# EAGLE design switch (EAGLE 9.2.2)
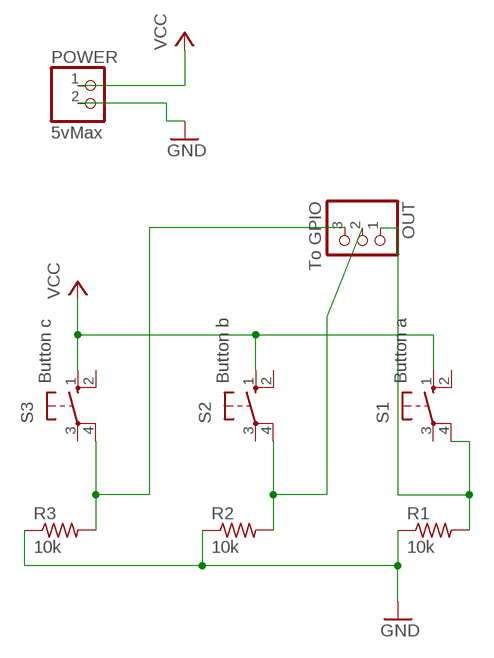
[diagram p0: schematic, sheet 1]

## Parts
OUT  To GPIO  PINHD-1X3  [1X03]
POWER  5vMax  PINHD-1X2  [1X02]
R1  10k  R-US_0204/7  [0204/7]
R2  10k  R-US_0204/7  [0204/7]
R3  10k  R-US_0204/7  [0204/7]
S1  Button a  10-XX  [B3F-10XX]
S2  Button b  10-XX  [B3F-10XX]
S3  Button c  10-XX  [B3F-10XX]

## Nets
GND: POWER.2 R1.1 R2.1 R3.1
N$1: OUT.3 R3.2 S3.4(P1)
N$2: OUT.2 R2.2 S2.4(P1)
N$3: OUT.1 R1.2 S1.4(P1)
VCC: POWER.1 S1.1(S) S2.1(S) S3.1(S)
Unconnected: S1.2(S1) S1.3(P) S2.2(S1) S2.3(P) S3.2(S1) S3.3(P)

## Library data of the parts
OUT = pinhead:PINHD-1X3: PIN HEADER
POWER = pinhead:PINHD-1X2: PIN HEADER
R1-R3 = adafruit:R-US_: RESISTOR, American symbol
S1-S3 = switch-omron:10-XX: OMRON SWITCH; MPN: B3F-1000; OC_FARNELL: 176432; OC_NEWARK: 36M3542

## Board
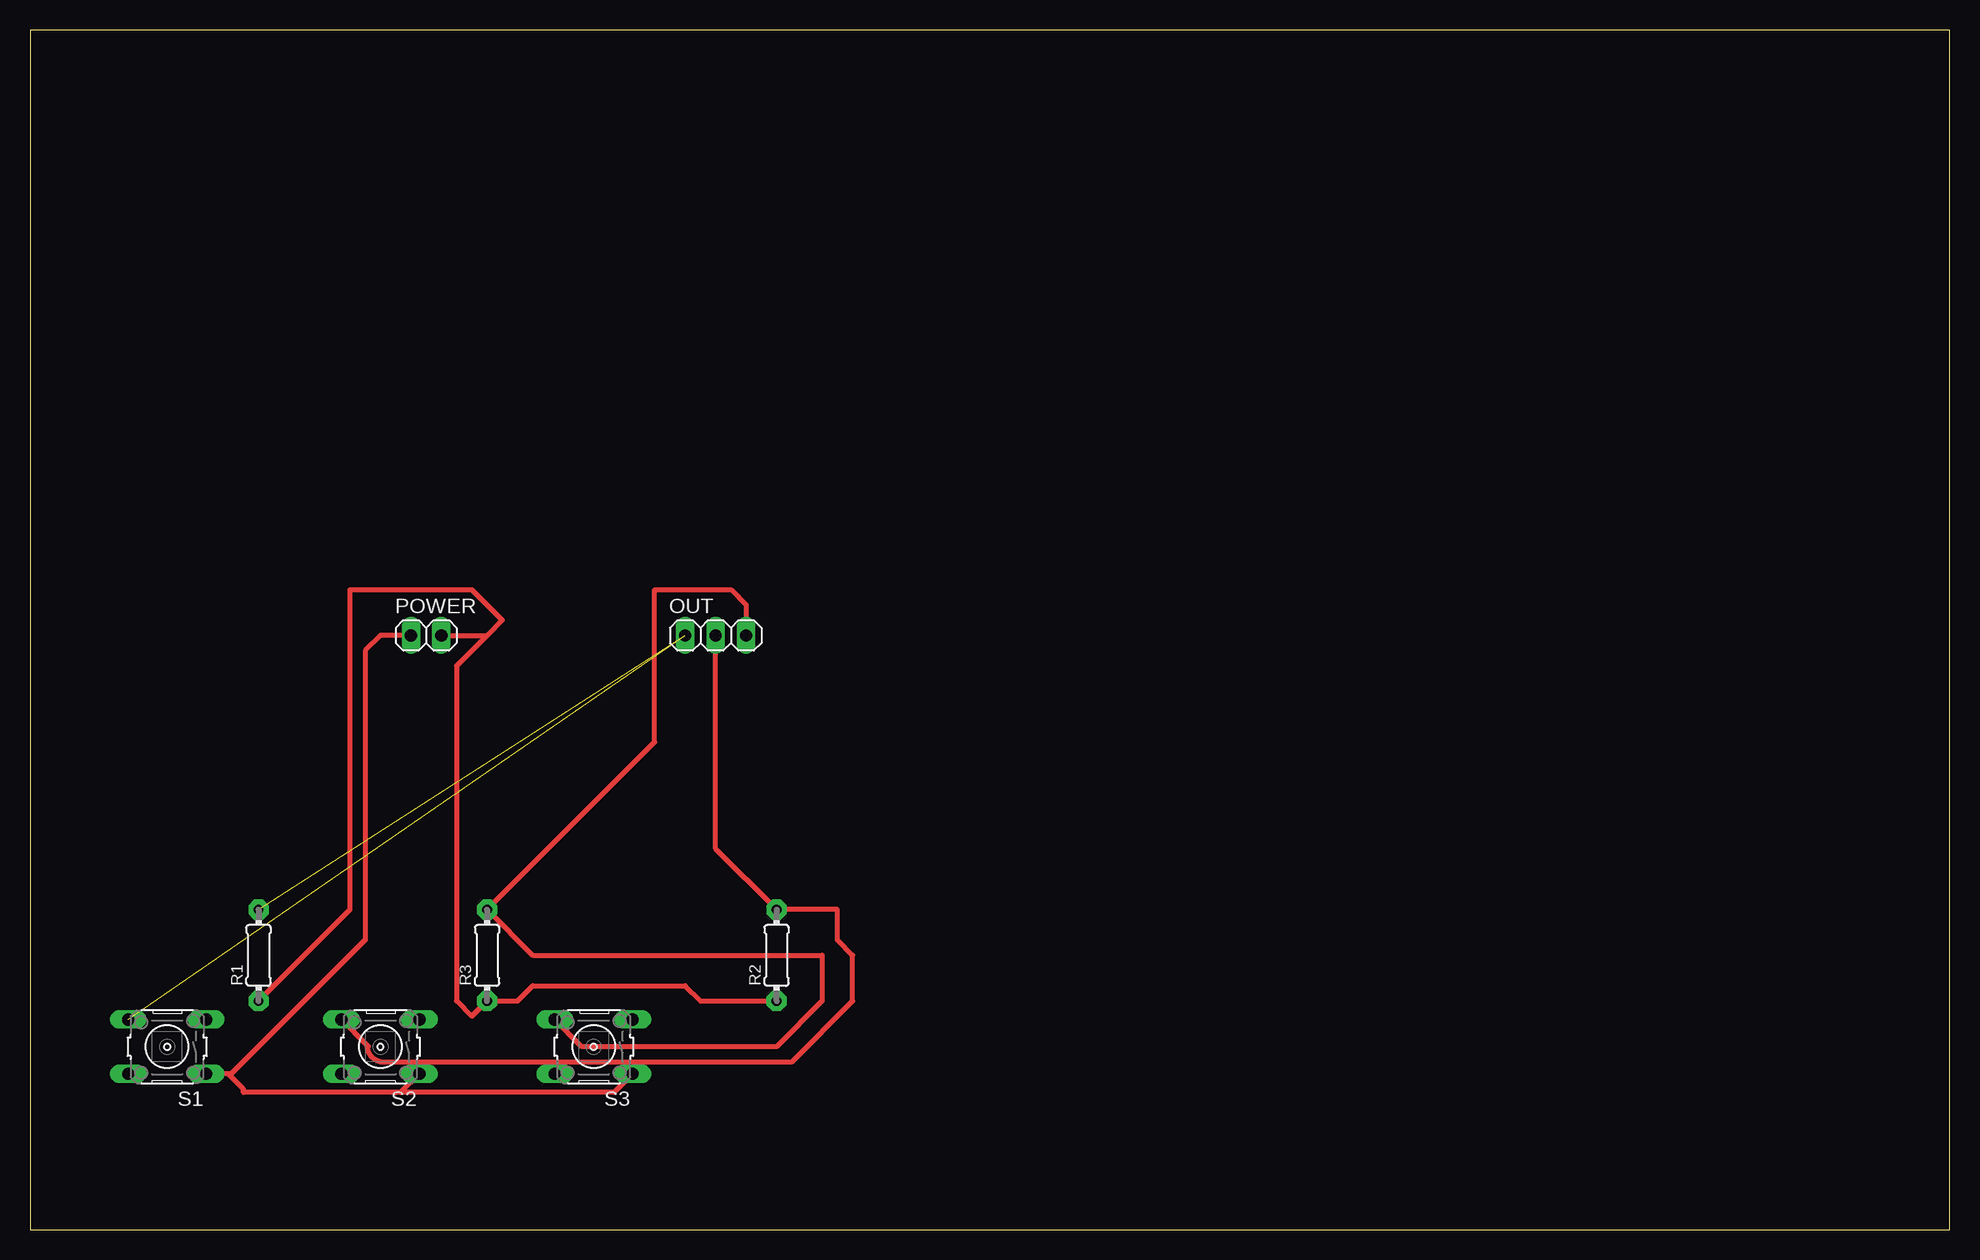
[diagram p1: board, top side]

Size 160 x 100 mm. Coordinates in mm from the lower left corner, seen from the top.
Outline: 0,0 160,0 160,100 0,100 0,0
Copper layers (1*16): Top 0.035mm / dielectric 1.5mm / Bottom 0.035mm
Design rules "default": minimum track width 6mil, minimum drill 0.35mm, track to track 6mil, track to pad 6mil, pad to pad 6mil, via to via 6mil, smd to smd 6mil, copper to edge 40mil, drill to drill 6mil, minimum pad ring 10mil, minimum via ring 8mil, stop-mask expansion 4mil, vias tented up to drill 0mil, thermal gap 10mil

### Footprints (pad centres in the part's own frame; a part is rotated, then mirrored left to right if it is on the bottom)
1X03 = drill 1.016 long: 1 -2.54,0; 2 0,0; 3 2.54,0
1X02 = drill 1.016 long: 1 -1.27,0; 2 1.27,0
0204/7 = drill 0.813 pad 1.676 octagon: 1 -3.81,0; 2 3.81,0
B3F-10XX = drill 1.016 long: 1 -3.251,2.261; 2 3.251,2.261; 3 -3.251,-2.261; 4 3.251,-2.261

### Placement (x,y rotation side)
OUT  57.15,49.53 0 top
POWER  33.02,49.53 0 top
R1  19.05,22.86 90 top
R2  62.23,22.86 90 top
R3  38.1,22.86 90 top
S1  11.43,15.24 180 top
S2  29.21,15.24 180 top
S3  46.99,15.24 180 top

### Tracks (layer width: path | path; a pad name or v marks a point on that pad's centre or on a via)
GND
  Top 0.406: R1.1 26.67,26.67 26.67,53.34 36.83,53.34 39.37,50.8 38.1,49.53 | 38.1,49.53 35.56,46.99 35.56,19.05 36.83,17.78 R3.1 40.64,19.05 41.91,20.32 54.61,20.32 55.88,19.05 R2.1 | POWER.2 38.1,49.53
N$1
  Top 0.406: OUT.3 59.69,52.07 58.42,53.34 52.07,53.34 52.07,40.64 R3.2 41.91,22.86 66.04,22.86 66.04,19.05 62.23,15.24 46,15.24 S3.4
N$2
  Top 0.406: OUT.2 57.15,31.75 R2.2 67.31,26.67 67.31,24.13 68.58,22.86 68.58,19.05 63.5,13.97 29.49,13.97 arc-90 28.08,15.38 | S2.4 28.08,15.38 | 28.08,15.38 28.22,15.24
N$3  (2 unrouted)
VCC
  Top 0.406: POWER.1 29.21,49.53 27.94,48.26 27.94,24.13 16.79,12.98 16.51,12.98 | 16.51,12.98 S1.1 | S2.1 30.91,11.43 | 30.91,11.43 30.48,11.43 17.78,11.43 17.78,11.71 16.51,12.98 | S3.1 48.69,11.43 30.91,11.43